# Altium schematic sheet EEG Preprocessing.SchDoc: EEG Measurement Circuit
size A2; Date: 24/01/2025; DrawnBy: Giang Phan Truong; SheetNumber: 4; SheetTotal: 7; SPICEModelCacheZASXATAV: <root> / <DocumentId>ZASXATAV</DocumentId> / </root>
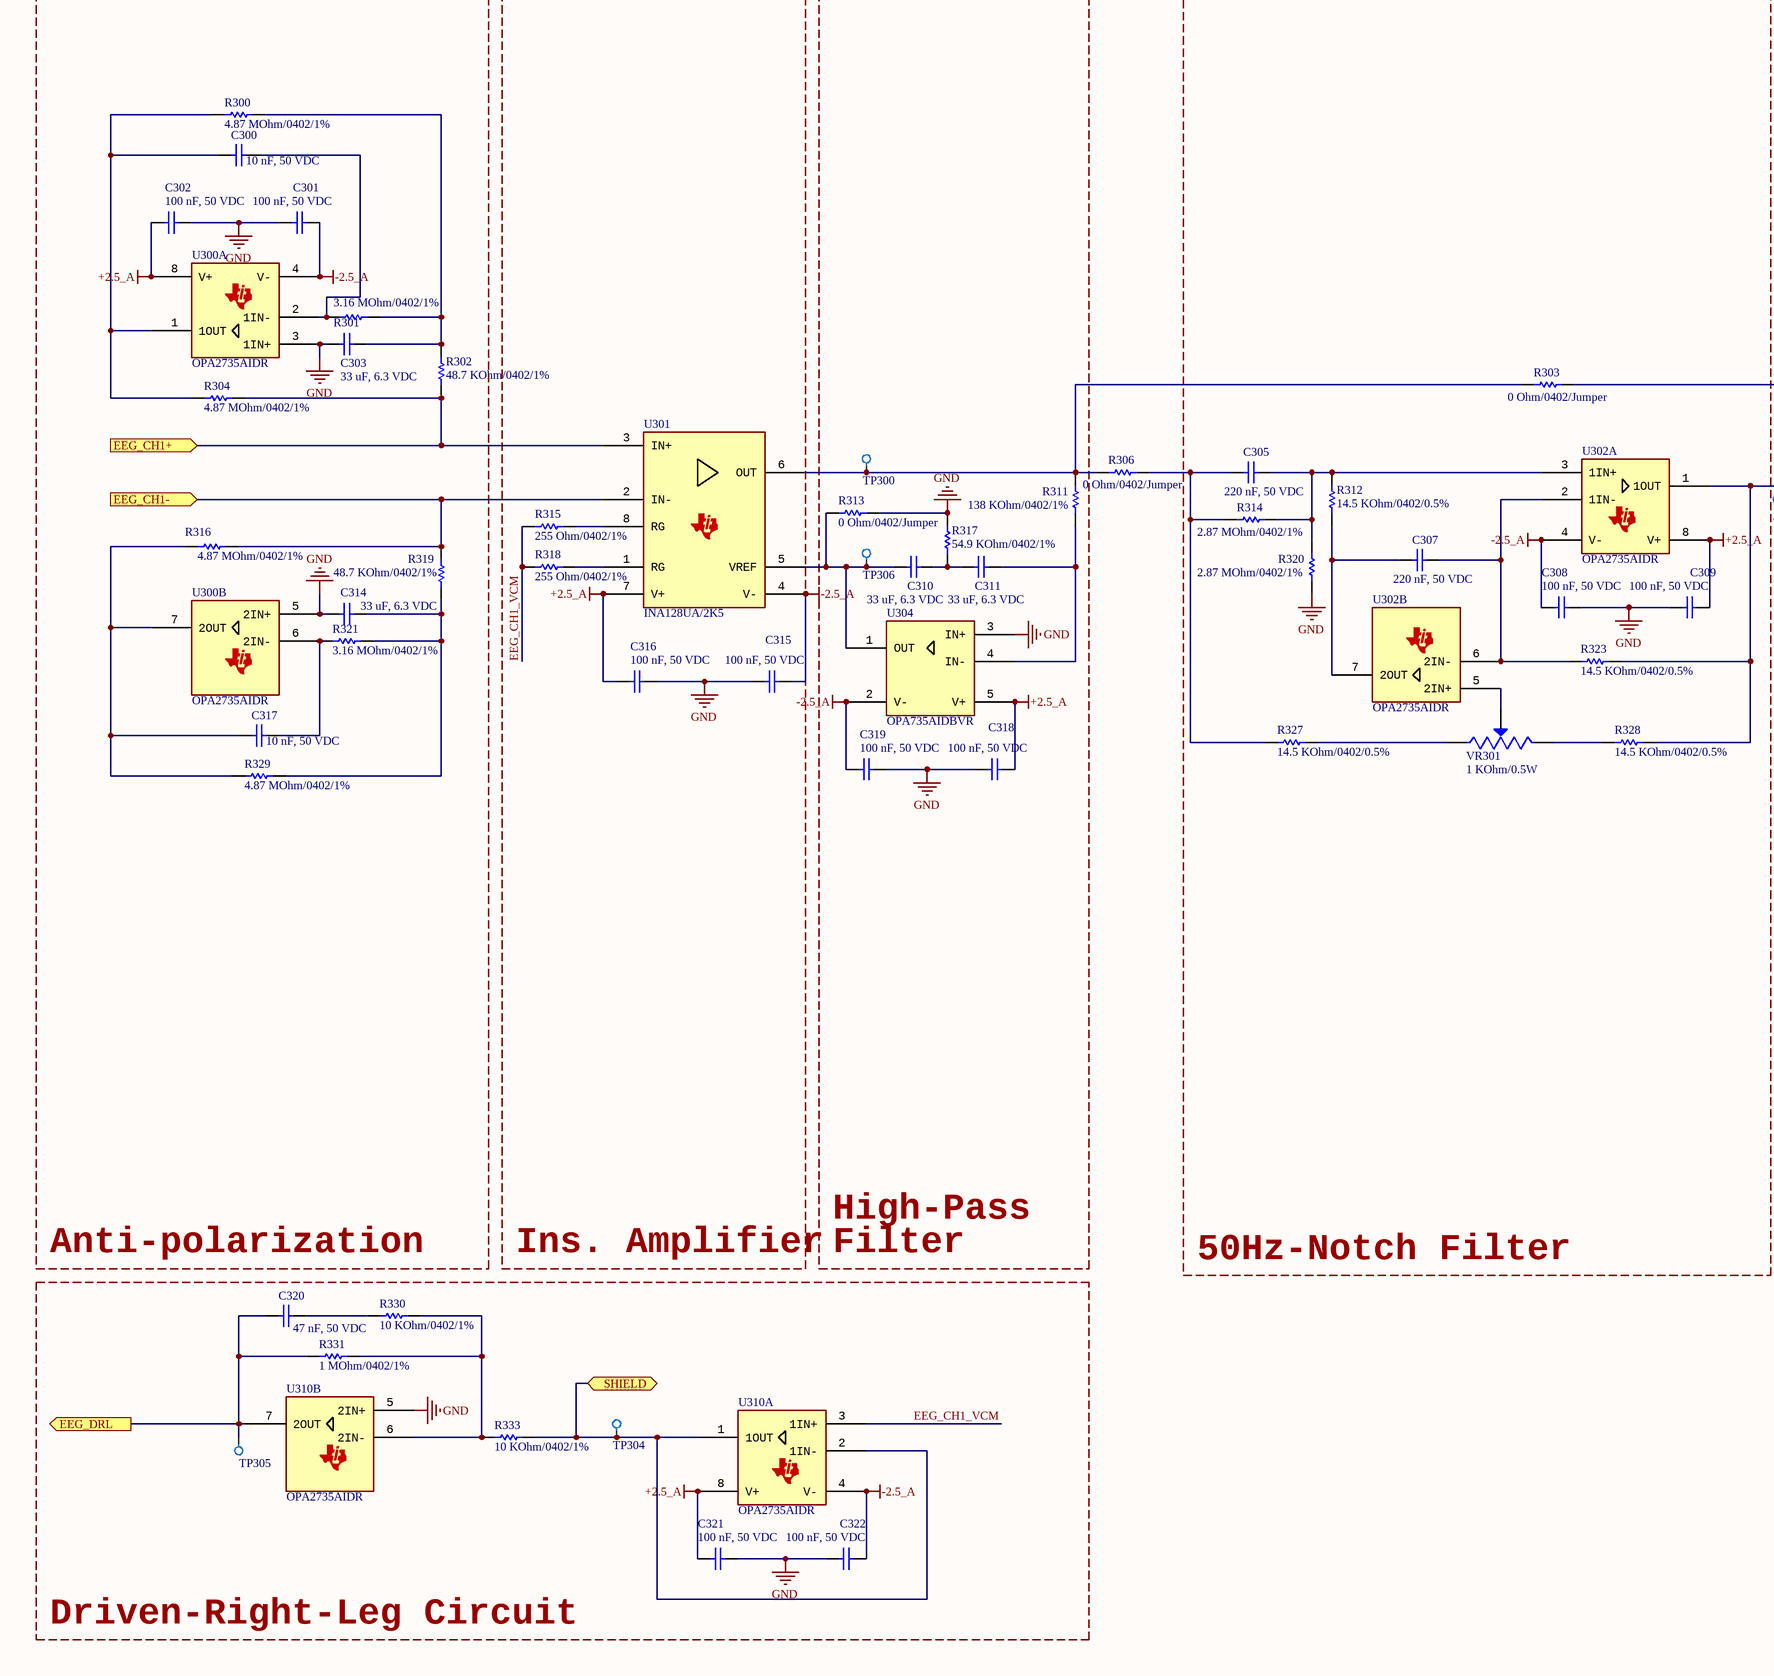
[diagram p0: EEG Preprocessing.SchDoc, left]
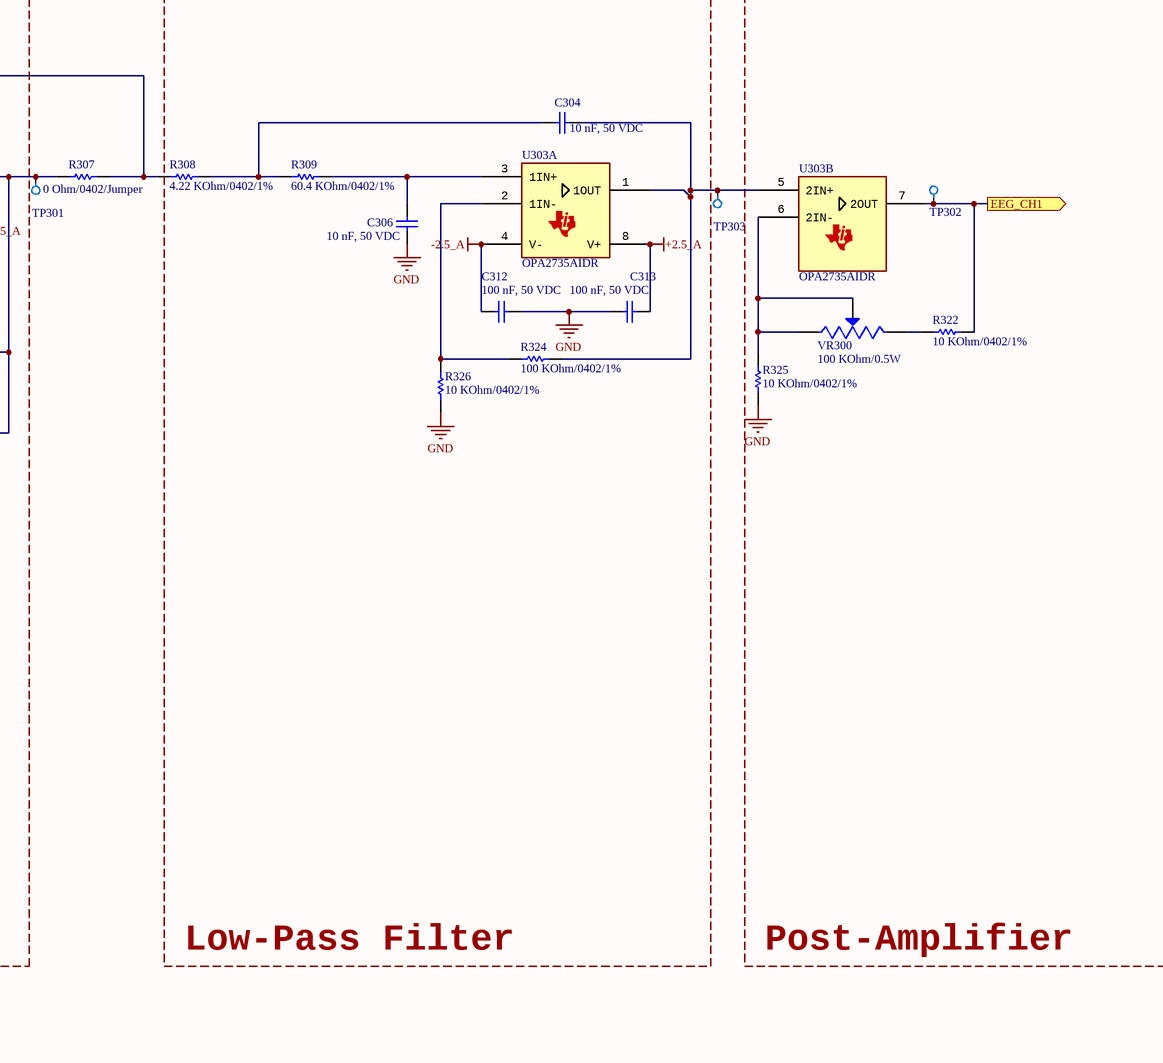
[diagram p1: EEG Preprocessing.SchDoc, right]

## Parts
C300  10 nF, 50 VDC  [CAP_0603]
C301  100 nF, 50 VDC  [CAP_0603]
C302  100 nF, 50 VDC  [CAP_0603]
C303  33 uF, 6.3 VDC  [CAP_0805]
C304  10 nF, 50 VDC  [CAP_0603]
C305  220 nF, 50 VDC  [CAP_0603]
C306  10 nF, 50 VDC  [CAP_0603]
C307  220 nF, 50 VDC  [CAP_0603]
C308  100 nF, 50 VDC  [CAP_0603]
C309  100 nF, 50 VDC  [CAP_0603]
C310  33 uF, 6.3 VDC  [CAP_0805]
C311  33 uF, 6.3 VDC  [CAP_0805]
C312  100 nF, 50 VDC  [CAP_0603]
C313  100 nF, 50 VDC  [CAP_0603]
C314  33 uF, 6.3 VDC  [CAP_0805]
C315  100 nF, 50 VDC  [CAP_0603]
C316  100 nF, 50 VDC  [CAP_0603]
C317  10 nF, 50 VDC  [CAP_0603]
C318  100 nF, 50 VDC  [CAP_0603]
C319  100 nF, 50 VDC  [CAP_0603]
C320  47 nF, 50 VDC  [CAP_0603]
C321  100 nF, 50 VDC  [CAP_0603]
C322  100 nF, 50 VDC  [CAP_0603]
R300  value 4.87 MOhm/0402/1%  [R0402]  (hidden comment: Resistor 4.87 MOhm 0402 1%)
R301  value 3.16 MOhm/0402/1%  [R0402]  (hidden comment: Resistor 3.16 MOhm 0402 1%)
R302  value 48.7 KOhm/0402/1%  [R0402]  (hidden comment: Resistor 48.7 KOhm 0402 1%)
R303  value 0 Ohm/0402/Jumper  [R0402]  (hidden comment: Resistor 0 Ohm 0402)
R304  value 4.87 MOhm/0402/1%  [R0402]  (hidden comment: Resistor 4.87 MOhm 0402 1%)
R306  value 0 Ohm/0402/Jumper  [R0402]  (hidden comment: Resistor 0 Ohm 0402)
R307  value 0 Ohm/0402/Jumper  [R0402]  (hidden comment: Resistor 0 Ohm 0402)
R308  value 4.22 KOhm/0402/1%  [R0402]  (hidden comment: Resistor 4.22 KOhm 0402 1%)
R309  value 60.4 KOhm/0402/1%  [R0402]  (hidden comment: Resistor 60.4 KOhm 0402 1%)
R311  value 138 KOhm/0402/1%  [R0402]  (hidden comment: Resistor 138 KOhm 0402 1%)
R312  value 14.5 KOhm/0402/0.5%  [R0402]  (hidden comment: Resistor 14.5 KOhm 0402 0.5%)
R313  value 0 Ohm/0402/Jumper  [R0402]  (hidden comment: Resistor 0 Ohm 0402)
R314  value 2.87 MOhm/0402/1%  [R0402]  (hidden comment: Resistor 2.87 MOhm 0402 1%)
R315  value 255 Ohm/0402/1%  [R0402]  (hidden comment: Resistor 255 Ohm 0402 1%)
R316  value 4.87 MOhm/0402/1%  [R0402]  (hidden comment: Resistor 4.87 MOhm 0402 1%)
R317  value 54.9 KOhm/0402/1%  [R0402]  (hidden comment: Resistor 54.9 KOhm 0402 1%)
R318  value 255 Ohm/0402/1%  [R0402]  (hidden comment: Resistor 255 Ohm 0402 1%)
R319  value 48.7 KOhm/0402/1%  [R0402]  (hidden comment: Resistor 48.7 KOhm 0402 1%)
R320  value 2.87 MOhm/0402/1%  [R0402]  (hidden comment: Resistor 2.87 MOhm 0402 1%)
R321  value 3.16 MOhm/0402/1%  [R0402]  (hidden comment: Resistor 3.16 MOhm 0402 1%)
R322  value 10 KOhm/0402/1%  [R0402]  (hidden comment: Resistor 10 KOhm 0402 1%)
R323  value 14.5 KOhm/0402/0.5%  [R0402]  (hidden comment: Resistor 14.5 KOhm 0402 0.5%)
R324  value 100 KOhm/0402/1%  [R0402]  (hidden comment: Resistor 100 KOhm 0402 1%)
R325  value 10 KOhm/0402/1%  [R0402]  (hidden comment: Resistor 10 KOhm 0402 1%)
R326  value 10 KOhm/0402/1%  [R0402]  (hidden comment: Resistor 10 KOhm 0402 1%)
R327  value 14.5 KOhm/0402/0.5%  [R0402]  (hidden comment: Resistor 14.5 KOhm 0402 0.5%)
R328  value 14.5 KOhm/0402/0.5%  [R0402]  (hidden comment: Resistor 14.5 KOhm 0402 0.5%)
R329  value 4.87 MOhm/0402/1%  [R0402]  (hidden comment: Resistor 4.87 MOhm 0402 1%)
R330  value 10 KOhm/0402/1%  [R0402]  (hidden comment: Resistor 10 KOhm 0402 1%)
R331  value 1 MOhm/0402/1%  [R0402]  (hidden comment: Resistor 1 MOhm 0402 1%_1)
R333  value 10 KOhm/0402/1%  [R0402]  (hidden comment: Resistor 10 KOhm 0402 1%)
TP300  Testpoint_TH  [TestPoint_THTPad_D1.5mm_Drill0.7mm]  (value not drawn)
TP301  Testpoint_TH  [TestPoint_THTPad_D1.5mm_Drill0.7mm]  (value not drawn)
TP302  Testpoint_TH  [TestPoint_THTPad_D1.5mm_Drill0.7mm]  (value not drawn)
TP303  Testpoint_TH  [TestPoint_THTPad_D1.5mm_Drill0.7mm]  (value not drawn)
TP304  Testpoint_TH  [TestPoint_THTPad_D1.5mm_Drill0.7mm]  (value not drawn)
TP305  Testpoint_TH  [TestPoint_THTPad_D1.5mm_Drill0.7mm]  (value not drawn)
TP306  Testpoint_TH  [TestPoint_THTPad_D1.5mm_Drill0.7mm]  (value not drawn)
U300  OPA2735AIDR  [SOIC-8]  (parts A,B of 2)
U301  INA128UA/2K5  [SOIC-8]
U302  OPA2735AIDR  [SOIC-8]  (parts A,B of 2)
U303  OPA2735AIDR  [SOIC-8]  (parts A,B of 2)
U304  OPA735AIDBVR  [SOT-23]
U310  OPA2735AIDR  [SOIC-8]  (parts A,B of 2)
VR300  value 100 KOhm/0.5W  [TRIM_3296W]  (hidden comment: 3296W-104)
VR301  value 1 KOhm/0.5W  [TRIM_3296W]  (hidden comment: 3296W-102)

## Blocks framed on the sheet
Anti-polarization: C300-C303 C314 C317 R300-R302 R304 R316 R319 R321 R329 U300
Ins. Amplifier: C315 C316 R315 R318 U301
50Hz-Notch Filter: C305 C307-C309 R303 R312 R314 R320 R323 R327 R328 U302 VR301
Low-Pass Filter: C304 C306 C312 C313 R308 R309 R324 R326 U303
Post-Amplifier: R322 R325 TP302 U303 VR300
Driven-Right-Leg Circuit: C320-C322 R330 R331 R333 TP304 TP305 U310

## Ports
EEG_CH1 (out, see Block Diagram[4B], ADC[1B]), EEG_CH1+ (in, see Block Diagram[3B], Patient Protection[5B]), EEG_CH1- (in, see Block Diagram[3B], Patient Protection[5B]), EEG_DRL (out, see Block Diagram[3B], Patient Protection[5C]), SHIELD (bidir, see Block Diagram[3B], Patient Protection[4C])

## Nets
+2.5_A: C302.2 C309.1 C313.1 C316.2 C318.1 C321.2 U300.8(V+) U301.7(V+) U302.8(V+) U303.8(V+) U304.5(V+) U310.8(V+)
-2.5_A: C301.1 C308.2 C312.2 C315.1 C319.2 C322.1 U300.4(V-) U301.4(V-) U302.4(V-) U303.4(V-) U304.2(V-) U310.4(V-)
GND: C301.2 C302.1 C303.1 C306.1 C308.1 C309.2 C312.1 C313.2 C314.1 C315.2 C316.1 C318.2 C319.1 C321.1 C322.2 R313.1 R317.1 R320.1 R325.1 R326.1 U300.3(1IN+) U300.5(2IN+) U304.3(IN+) U310.5(2IN+)
EEG_CH1: R322.1 TP302.1 U303.7(2OUT) ; port EEG_CH1
EEG_CH1+: R302.1 R304.2 U301.3(IN+) ; port EEG_CH1+
EEG_CH1-: R316.2 R319.2 U301.2(IN-) ; port EEG_CH1-
EEG_CH1_VCM: R315.2 R318.2 U310.3(1IN+)
EEG_DRL: C320.1 R331.1 TP305.1 U310.7(2OUT) ; port EEG_DRL
SHIELD: R333.2 TP304.1 U310.1(1OUT) U310.2(1IN-) ; port SHIELD
NetC300_1: C300.1 R300.1 R304.1 U300.1(1OUT)
NetC300_2: C300.2 R301.1 U300.2(1IN-)
NetC303_2: C303.2 R300.2 R301.2 R302.2
NetC304_1: C304.1 R308.2 R309.1
NetC304_2: C304.2 R324.2 TP303.1 U303.1(1OUT) U303.5(2IN+)
NetC305_1: C305.1 R306.2 R314.1 R327.2
NetC305_2: C305.2 R312.2 R314.2 R320.2 U302.3(1IN+)
NetC306_2: C306.2 R309.2 U303.3(1IN+)
NetC307_1: C307.1 R312.1 U302.7(2OUT)
NetC307_2: C307.2 R323.2 U302.2(1IN-) U302.6(2IN-)
NetC310_1: C310.1 R313.2 TP306.1 U301.5(VREF) U304.1(OUT)
NetC310_2: C310.2 C311.1 R317.2
NetC311_2: C311.2 R311.1 U304.4(IN-)
NetC314_2: C314.2 R319.1 R321.2 R329.2
NetC317_1: C317.1 R316.1 R329.1 U300.7(2OUT)
NetC317_2: C317.2 R321.1 U300.6(2IN-)
NetC320_2: C320.2 R330.1
NetR303_1: R303.1 R306.1 R311.2 TP300.1 U301.6(OUT)
NetR303_2: R303.2 R307.2 R308.1
NetR307_1: R307.1 R323.1 R328.1 TP301.1 U302.1(1OUT)
NetR315_1: R315.1 U301.8(RG)
NetR318_1: R318.1 U301.1(RG)
NetR322_2: R322.2 VR300.3(CW)
NetR324_1: R324.1 R326.2 U303.2(1IN-)
NetR325_2: R325.2 U303.6(2IN-) VR300.1(CCW) VR300.2(WIPER)
NetR327_1: R327.1 VR301.1(CCW)
NetR328_2: R328.2 VR301.3(CW)
NetR330_2: R330.2 R331.2 R333.1 U310.6(2IN-)
NetU302_5: U302.5(2IN+) VR301.2(WIPER)

## Notes on the sheet
- High-Pass
- Filter
- Project Name:
- Date:
- Size
- Size:
- A2
- Last Modified:
- Revision:
- Drawn By:
- File:
- Checked By:
- Sheet
- of

## Library data of the parts
C300 C304 C306 C317 = 0106031030550: CAP, size 0603, 10 nF, 50 VDC; Manufacture Name: TDK; Manufacture SN: CGA3E2C0G1H103J080AE; Capacitance: 10 nF; Tolerance: +/-5%; Voltage Rating DC: 50 VDC; ComponentLink2Description: Datasheet; ComponentLink2URL: https://product.tdk.com/system/files/dam/doc/product/capacitor/ceramic/mlcc/catalog/mlcc_automotive_soft_en.pdf?ref_disty=mouser; Operating Temperature: -55 to +125degC; Packaging: Tape and Reel; Mounting Technology: SMT; Size: 0603; Supplier 1 Name: Mouser; Supplier 1 SN: 810-CGA3E2C0G1H103J8; Supplier 1 URL: https://www.mouser.com/ProductDetail/TDK/CGA3E2C0G1H103J080AE?qs=P1JMDcb91o6ZkMITrWTUZQ%3D%3D&utm_source=mouser-refine-download&utm_medium=file&utm_campaign=CGA3E2C0G1H103J080AE&utm_content=TDK; Supplier 2 Name: Digi-Key; Supplier 2 SN: 445-CGA3E2C0G1H103J080AETR-ND; Supplier 2 URL: https://www.digikey.com/en/products/detail/tdk-corporation/cga3e2c0g1h103j080ae/11697946; Supplier 3 Name: thegioiic; Supplier 3 SN: N/A; Supplier 3 URL: N/A; Value: 10 nF, 50 VDC
C301 C302 C308 C309 C312 C313 C315 C316 C318 C319 C321 C322 = 0106031041050: CAP, size 0603, 100 nF, 50 VDC; Manufacture Name: TDK; Manufacture SN: CGA3E3X8R1H104K080AE; Capacitance: 100 nF; Tolerance: +/-10%; Voltage Rating DC: 50 VDC; ComponentLink2Description: Datasheet; ComponentLink2URL: https://product.tdk.com/system/files/dam/doc/product/capacitor/ceramic/mlcc/catalog/mlcc_automotive_soft_en.pdf?ref_disty=mouser; Operating Temperature: -55 to +125degC; Packaging: Tape and Reel; Mounting Technology: SMT; Size: 0603; Supplier 1 Name: Mouser; Supplier 1 SN: 810-CGA3E3X8R1H104KA; Supplier 1 URL: https://www.mouser.com/ProductDetail/TDK/CGA3E3X8R1H104K080AE?qs=nQSIdc08i%252Bd8g3IRRgU2bw%3D%3D&utm_source=mouser-refine-download&utm_medium=file&utm_campaign=CGA3E3X8R1H104K080AE&utm_content=TDK; Supplier 2 Name: Digi-Key; Supplier 2 SN: 445-173697-2-ND; Supplier 2 URL: https://www.digikey.com/en/products/detail/tdk-corporation/cga3e3x8r1h104k080ae/5809262; Supplier 3 Name: thegioiic; Supplier 3 SN: N/A; Supplier 3 URL: N/A; Value: 100 nF, 50 VDC
C303 C310 C311 C314 = 0108051061025: 33 µF ±20% 6.3V Ceramic Capacitor X5R 0805 (2012 Metric); Manufacture Name: TDK; Manufacture SN: CGA4J1X7S1E106K125AE; Capacitance: 10 uF; Tolerance: +/-10%; Voltage Rating DC: 25 VDC; Operating Temperature: -55 to +125degC; Packaging: Tape and Reel; Mounting Technology: SMT; Size: 0805; Supplier 1 Name: Mouser; Supplier 1 SN: 810-CGA4J1X7S1E106K2; Supplier 1 URL: https://www.mouser.vn/ProductDetail/TDK/CGA4J1X7S1E106K125AE?qs=PqoDHHvF64%252BJvhmUzM2odA%3D%3D&utm_source=mouser-refine-download&utm_medium=file&utm_campaign=CGA4J1X7S1E106K125AE&utm_content=TDK; Supplier 2 Name: Digi-Key; Supplier 2 SN: 445-181411-2-ND; Supplier 2 URL: https://www.digikey.com/en/products/detail/tdk-corporation/cga4j1x7s1e106k125ae/9744777; Supplier 3 Name: thegioiic; Supplier 3 SN: OEM; Supplier 3 URL: N/A; Value: 33 uF, 6.3 VDC; ComponentLink3Description: Buy; ComponentLink3URL: https://www.digikey.com/en/products/detail/tdk-corporation/C2012X5R0J336M125AC/2443464
C305 C307 = 0106032241050: CAP, size 0603, 220 nF, 50 VDC; Manufacture Name: TDK; Manufacture SN: CGA3E3X7R1H224K080AE; Capacitance: 220 nF; Tolerance: +/-10%; Voltage Rating DC: 50 VDC; ComponentLink2Description: Datasheet; ComponentLink2URL: https://product.tdk.com/system/files/dam/doc/product/capacitor/ceramic/mlcc/catalog/mlcc_automotive_soft_en.pdf?ref_disty=mouser; Operating Temperature: -55 to +125degC; Packaging: Tape and Reel; Mounting Technology: SMT; Size: 0603; Supplier 1 Name: Mouser; Supplier 1 SN: 810-CGA3E3X7R1H224KA; Supplier 1 URL: https://www.mouser.com/ProductDetail/TDK/CGA3E3X7R1H224K080AE?qs=nQSIdc08i%252Bd73MzLq310Yg%3D%3D&utm_source=mouser-refine-download&utm_medium=file&utm_campaign=CGA3E3X7R1H224K080AE&utm_content=TDK; Supplier 2 Name: Digi-Key; Supplier 2 SN: 445-173635-2-ND; Supplier 2 URL: https://www.digikey.com/en/products/detail/tdk-corporation/cga3e3x7r1h224k080ae/5809200; Supplier 3 Name: thegioiic; Supplier 3 SN: N/A; Supplier 3 URL: N/A; Value: 220 nF, 50 VDC
C320 = 0106034731050: CAP, size 0603, 47 nF, 50 VDC; Manufacture Name: TDK; Manufacture SN: CGA3E2X7R1H473K080AA; Capacitance: 47 nF; Tolerance: +/-10%; Voltage Rating DC: 50 VDC; ComponentLink2Description: Datasheet; ComponentLink2URL: https://product.tdk.com/system/files/dam/doc/product/capacitor/ceramic/mlcc/catalog/mlcc_automotive_general_en.pdf?ref_disty=mouser; Operating Temperature: -55 to +125degC; Packaging: Tape and Reel; Mounting Technology: SMT; Size: 0603; Supplier 1 Name: Mouser; Supplier 1 SN: 810-CGA3E2X7R1H473K; Supplier 1 URL: https://www.mouser.com/ProductDetail/TDK/CGA3E2X7R1H473K080AA?qs=NRhsANhppD%252BXNlr9LoLgTw%3D%3D&utm_source=mouser-refine-download&utm_medium=file&utm_campaign=CGA3E2X7R1H473K080AA&utm_content=TDK; Supplier 2 Name: Digi-Key; Supplier 2 SN: 445-5664-2-ND; Supplier 2 URL: https://www.digikey.com/en/products/detail/tdk-corporation/cga3e2x7r1h473k080aa/2443142; Supplier 3 Name: thegioiic; Supplier 3 SN: N/A; Supplier 3 URL: N/A; Value: 47 nF, 50 VDC
R300 R304 R316 R329 = Resistor 4.87 MOhm 0402 1%: 4.87 MOhms ±1% 0.063W, 1/16W Chip Resistor 0402 (1005 Metric) Moisture Resistant Thick Film; ComponentLink1Description: Buy; ComponentLink1URL: https://www.digikey.com/en/products/detail/yageo/RC0402FR-074M87L/5917698
R301 R321 = Resistor 3.16 MOhm 0402 1%: 3.16 MOhms ±1% 0.063W, 1/16W Chip Resistor 0402 (1005 Metric) Automotive AEC-Q200 Thick Film; ComponentLink1Description: Buy; ComponentLink1URL: https://www.digikey.com/en/products/detail/vishay-dale/CRCW04023M16FKED/1178404
R302 R319 = Resistor 48.7 KOhm 0402 1%: 48.7 kOhms ±1% 0.063W, 1/16W Chip Resistor 0402 (1005 Metric) Automotive AEC-Q200, Moisture Resistant Thick Film; ComponentLink1Description: Buy; ComponentLink1URL: https://www.digikey.com/en/products/detail/yageo/AC0402FR-0748K7L/5895382
R303 R306 R307 R313 = Resistor 0 Ohm 0402: 0 Ohms Jumper Chip Resistor 0402 (1005 Metric) Moisture Resistant Thick Film; ComponentLink1Description: Buy; ComponentLink1URL: https://www.digikey.com/en/products/detail/yageo/RC0402JR-070RL/726406
R308 = Resistor 4.22 KOhm 0402 1%: 4.22 kOhms ±1% 0.1W, 1/10W Chip Resistor 0402 (1005 Metric) Automotive AEC-Q200 Thick Film; ComponentLink1Description: Buy; ComponentLink1URL: https://www.digikey.com/en/products/detail/panasonic-electronic-components/ERJ-2RKF4221X/192338
R309 = Resistor 60.4 KOhm 0402 1%: 60.4 kOhms ±1% 0.063W, 1/16W Chip Resistor 0402 (1005 Metric) Moisture Resistant Thick Film; ComponentLink1Description: Buy; ComponentLink1URL: https://www.digikey.com/en/products/detail/yageo/RC0402FR-0760K4L/726643
R311 = Resistor 138 KOhm 0402 1%: 138 kOhms ±1% 0.1W, 1/10W Chip Resistor 0402 (1005 Metric) Automotive AEC-Q200, Moisture Resistant Thin Film; ComponentLink1Description: Buy; ComponentLink1URL: https://www.digikey.com/en/products/detail/koa-speer-electronics-inc/RN73R1ETTP1383F25/10000727
R312 R323 R327 R328 = Resistor 14.5 KOhm 0402 0.5%: 14.5 kOhms ±0.5% 0.063W, 1/16W Chip Resistor 0402 (1005 Metric) Thin Film; ComponentLink1Description: Buy; ComponentLink1URL: https://www.digikey.com/en/products/detail/yageo/RT0402DRD0714K5L/7708273
R314 R320 = Resistor 2.87 MOhm 0402 1%: 2.87 MOhms ±1% 0.063W, 1/16W Chip Resistor 0402 (1005 Metric) Automotive AEC-Q200 Thick Film; ComponentLink1Description: Buy; ComponentLink1URL: https://www.digikey.com/en/products/detail/vishay-dale/CRCW04022M87FKED/1178399
R315 R318 = Resistor 255 Ohm 0402 1%: 255 Ohms ±1% 0.1W, 1/10W Chip Resistor 0402 (1005 Metric) Automotive AEC-Q200 Thick Film; ComponentLink1Description: Buy; ComponentLink1URL: https://www.digikey.com/en/products/detail/panasonic-electronic-components/ERJ-2RKF2550X/192252
R317 = Resistor 54.9 KOhm 0402 1%: 138 kOhms ±1% 0.1W, 1/10W Chip Resistor 0402 (1005 Metric) Automotive AEC-Q200, Moisture Resistant Thin Film; ComponentLink1Description: Buy; ComponentLink1URL: https://www.digikey.com/en/products/detail/yageo/RC0402FR-1354K9L/17024812
R322 R325 R326 R330 R333 = Resistor 10 KOhm 0402 1%: Code 103, 1/16W 1%; ComponentLink1Description: Buy; ComponentLink1URL: https://www.thegioiic.com/dien-tro-10-kohm-0402-1-
R324 = Resistor 100 KOhm 0402 1%: Code 104, 1/16W 1%; ComponentLink1Description: Buy; ComponentLink1URL: https://www.thegioiic.com/dien-tro-100-kohm-0402-1-
R331 = Resistor 1 MOhm 0402 1%_1: Code 105, 1/16W 1%; ComponentLink1Description: Buy; ComponentLink1URL: https://www.thegioiic.com/dien-tro-1-mohm-0402-1-
TP300-TP306 = Testpoint_TH: Test Point TEST-1BK; Supply Name: BanLinhKien; Datasheet: *; Supply Part Number: Test Point TEST-1BK; Supply URL: https://banlinhkien.com/test-point-test1bk-mau-den-5c-p18255999.html
U300 U302 U303 U310 = OPA2735AIDR: 0.05μV/°C max, Single-Supply CMOS Operational Amplifiers Zero-drift Series; ComponentLink1Description: Buy; ComponentLink1URL: https://www.digikey.com/en/products/detail/texas-instruments/OPA2735AIDR/1572381; Value: OPA2735AIDR
U301 = INA128UA/2K5: Precision, Low Power Instrumentation Amplifiers; ComponentLink1Description: Buy; ComponentLink1URL: https://www.digikey.com/en/products/detail/texas-instruments/INA128UA-2K5/300998; ComponentLink2Description: Datasheet; ComponentLink2URL: https://www.ti.com/lit/ds/symlink/ina129-ep.pdf?ts=1697381225295&ref_url=https%253A%252F%252Fwww.google.com%252F; Value: INA128UA/2K5
U304 = OPA735AIDBVR: Zero-Drift Amplifier 1 Circuit Rail-to-Rail SOT-23-5; Mfr_Name: Texas Instruments; RefDes: RefDes; Type: Type; ComponentLink1Description: Buy; ComponentLink1URL: https://www.digikey.com/en/products/detail/texas-instruments/OPA735AIDBVR/1572946; Value: OPA735AIDBVR
VR300 = 3296W-104: 100 KOhms 0.5W, PC Pins Through Hole Trimmer Potentiometer Cermet 25.0 Turn Top Adjustment; MF: Bourns; MP: 3296W-1-250; Purchase-URL: https://pricing.snapeda.com/search/part/3296W-1-250/?ref=eda; Check_prices: https://www.snapeda.com/parts/3296W-1-250/Bourns/view-part/?ref=eda; SnapEDA_Link: https://www.snapeda.com/parts/3296W-1-250/Bourns/view-part/?ref=snap; Price: None; Availability: In Stock; Package: NON STANDARD-3 Bourns; Buy: https://thegioiic.com/3296w-104-bien-tro-100-kohm-3-chan-chinh-top-0-5w
VR301 = 3296W-102: 1 KOhms 0.5W, PC Pins Through Hole Trimmer Potentiometer Cermet 25.0 Turn Top Adjustment; Buy: https://thegioiic.com/3296w-102-bien-tro-1-kohm-3-chan-chinh-top-0-5w